# EAGLE design DrvPAPCNC (EAGLE 6.3)
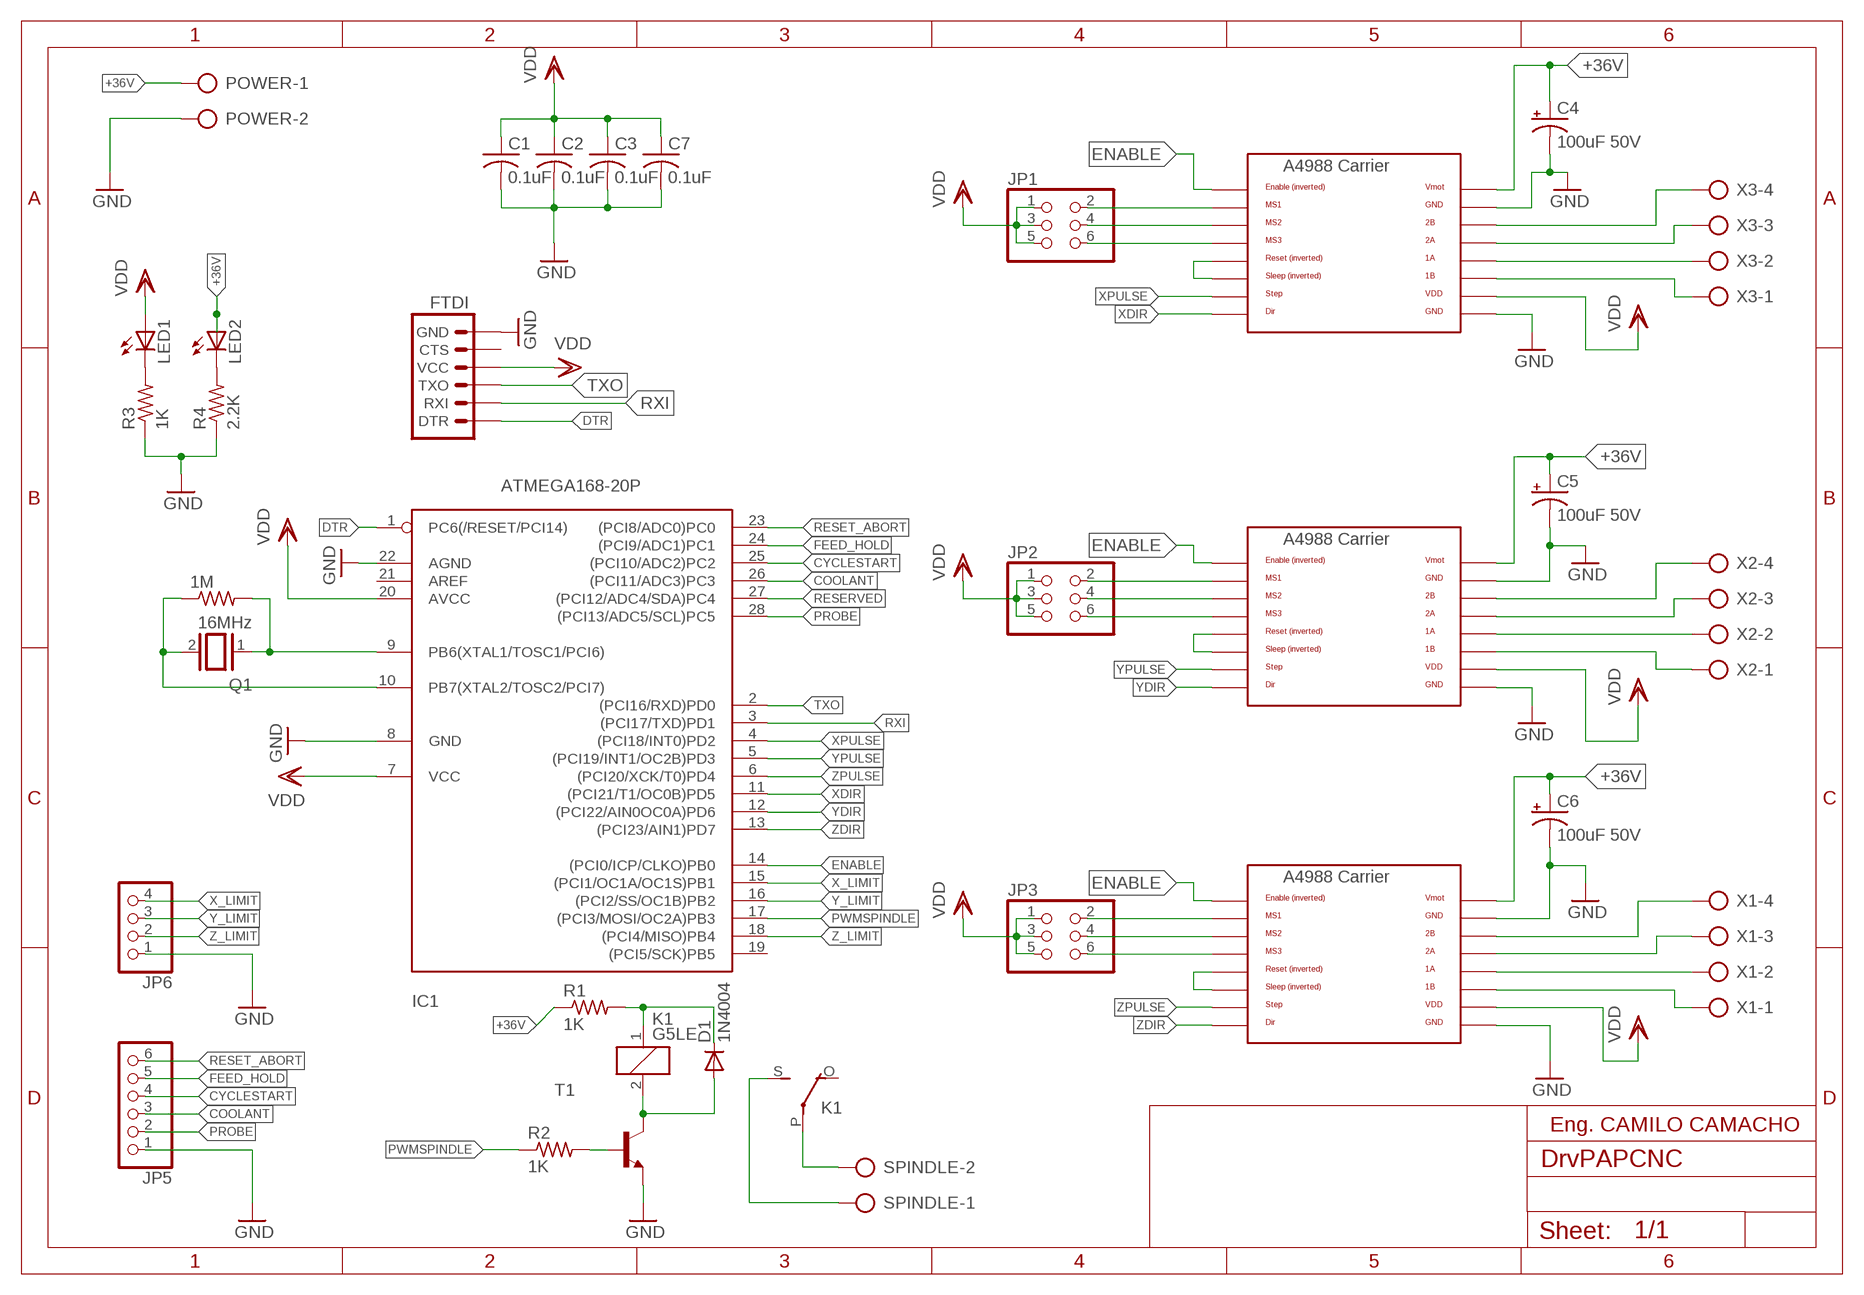
[diagram p0: schematic, sheet 1]

## Parts
1M  R-US_0204/2V  [0204V]
C1  0.1uF  C-US025-025X050  [C025-025X050]
C2  0.1uF  C-US025-025X050  [C025-025X050]
C3  0.1uF  C-US025-025X050  [C025-025X050]
C4  100uF 50V  CPOL-USE7.5-16  [E7,5-16]
C5  100uF 50V  CPOL-USE7.5-16  [E7,5-16]
C6  100uF 50V  CPOL-USE7.5-16  [E7,5-16]
C7  0.1uF  C-US025-025X050  [C025-025X050]
D1  1N4004  [DO41-10]
FTDI  ARDUINO_SERIAL_PROGRAMPTH  [1X06]
IC1  ATMEGA168-20P  [DIL28-3]
JP1  PINHD-2X3  [2X03]
JP2  PINHD-2X3  [2X03]
JP3  PINHD-2X3  [2X03]
JP5  PINHD-1X6  [1X06]
JP6  PINHD-1X4  [1X04]
K1  G5LE  [G5LE]
LED1  LED5MM  [LED5MM]
LED2  LED5MM  [LED5MM]
POWER  AK300/2  [AK300/2]
Q1  16MHz  XTAL/S  [QS]
R1  1K  R-US_0207/10  [0207/10]
R2  1K  R-US_0207/10  [0207/10]
R3  1K  R-US_0207/10  [0207/10]
R4  2.2K  R-US_0207/10  [0207/10]
SPINDLE  AK300/2  [AK300/2]
T1  2N3904-NPN-TO92-EBC  [TO92-EBC]
U$1  A4988BREAKOUT  [A4988BREAKOUT]
U$2  A4988BREAKOUT  [A4988BREAKOUT]
U$3  A4988BREAKOUT  [A4988BREAKOUT]
X1  AK300/4  [AK300/4]
X2  AK300/4  [AK300/4]
X3  AK300/4  [AK300/4]

## Nets
+36V: C4.+ C5.+ C6.+ LED2.A POWER.1 R1.1 U$1.VMOT U$2.VMOT U$3.VMOT
COOLANT: IC1.26((PCI11/ADC3)PC3) JP5.3
CYCLESTART: IC1.25((PCI10/ADC2)PC2) JP5.4
DTR: FTDI.1(DTR) IC1.1(PC6(/RESET/PCI14))
ENABLE: IC1.14((PCI0/ICP/CLKO)PB0) U$1.EN U$2.EN U$3.EN
FEED_HOLD: IC1.24((PCI9/ADC1)PC1) JP5.5
GND: C1.2 C2.2 C3.2 C4.- C5.- C6.- C7.2 FTDI.6(GND) IC1.8(GND) IC1.22(AGND) JP5.1 JP6.1 POWER.2 R3.1 R4.1 T1.E U$1.GND U$1.GND@0(GND) U$2.GND U$2.GND@0(GND) U$3.GND U$3.GND@0(GND)
N$1: U$1.2B X3.4
N$2: U$1.2A X3.3
N$3: U$1.1A X3.2
N$4: U$1.1B X3.1
N$5: U$2.1B X2.1
N$6: U$2.1A X2.2
N$7: U$2.2A X2.3
N$8: U$2.2B X2.4
N$9: U$3.2B X1.4
N$10: U$3.2A X1.3
N$11: U$3.1A X1.2
N$12: U$3.1B X1.1
N$13: K1.P(2:P) SPINDLE.2
N$14: K1.S(2:S) SPINDLE.1
N$16: JP1.2 U$1.MS1
N$17: JP1.4 U$1.MS2
N$18: JP1.6 U$1.MS3
N$19: JP2.2 U$2.MS1
N$20: JP2.4 U$2.MS2
N$21: JP2.6 U$2.MS3
N$22: JP3.2 U$3.MS1
N$23: JP3.4 U$3.MS2
N$24: JP3.6 U$3.MS3
N$25: U$3.RST U$3.SLP(SLEEP)
N$26: U$2.RST U$2.SLP(SLEEP)
N$27: U$1.RST U$1.SLP(SLEEP)
N$28: D1.C K1.1 R1.2
N$29: D1.A K1.2 T1.C
N$30: 1M.2 IC1.9(PB6(XTAL1/TOSC1/PCI6)) Q1.1
N$31: 1M.1 IC1.10(PB7(XTAL2/TOSC2/PCI7)) Q1.2
N$32: R2.2 T1.B
N$33: LED1.K(C) R3.2
N$34: LED2.K(C) R4.2
PROBE: IC1.28((PCI13/ADC5/SCL)PC5) JP5.2
PWMSPINDLE: IC1.17((PCI3/MOSI/OC2A)PB3) R2.1
RESERVED: IC1.27((PCI12/ADC4/SDA)PC4)
RESET_ABORT: IC1.23((PCI8/ADC0)PC0) JP5.6
RXI: FTDI.2(RXI) IC1.3((PCI17/TXD)PD1)
TXO: FTDI.3(TXO) IC1.2((PCI16/RXD)PD0)
VDD: C1.1 C2.1 C3.1 C7.1 FTDI.4(VCC) IC1.7(VCC) IC1.20(AVCC) JP1.1 JP1.3 JP1.5 JP2.1 JP2.3 JP2.5 JP3.1 JP3.3 JP3.5 LED1.A U$1.VDD U$2.VDD U$3.VDD
X_LIMIT: IC1.15((PCI1/OC1A/OC1S)PB1) JP6.4
XDIR: IC1.11((PCI21/T1/OC0B)PD5) U$1.DIR
XPULSE: IC1.4((PCI18/INT0)PD2) U$1.STEP
Y_LIMIT: IC1.16((PCI2/SS/OC1B)PB2) JP6.3
YDIR: IC1.12((PCI22/AIN0OC0A)PD6) U$2.DIR
YPULSE: IC1.5((PCI19/INT1/OC2B)PD3) U$2.STEP
Z_LIMIT: IC1.18((PCI4/MISO)PB4) JP6.2
ZDIR: IC1.13((PCI23/AIN1)PD7) U$3.DIR
ZPULSE: IC1.6((PCI20/XCK/T0)PD4) U$3.STEP
Unconnected: FTDI.5(CTS) IC1.19((PCI5/SCK)PB5) IC1.21(AREF) K1.O(2:O)

## Notes on the sheet
- Eng. CAMILO CAMACHO

## Library data of the parts
1M R1-R4 = rcl:R-US_: RESISTOR, American symbol
C1-C3 C7 = adafruit:C-US: CAPACITOR, American symbol
C4-C6 = adafruit:CPOL-US: POLARIZED CAPACITOR, American symbol
D1 = diode:1N4004: DIODE general purpose rectifier, 1 A
FTDI = SparkFun-Connectors:ARDUINO_SERIAL_PROGRAM: FTDI connector footprints
IC1 = adafruit:ATMEGA168*P: MICROCONTROLLER 16 kBytes FLASH 1 kBytes SRAM 512 Bytes EEPROM USART 8-channel 10 bit ADC
JP1-JP3 = pinhead:PINHD-2X3: PIN HEADER
JP5 = pinhead:PINHD-1X6: PIN HEADER
JP6 = pinhead:PINHD-1X4: PIN HEADER
K1 = relay:G5LE: RELAY 1 x switch, 10 A/120 V AC, 8 A/30 V DC, Omron; OC_FARNELL: unknown; OC_NEWARK: unknown
LED1 LED2 = adafruit:LED: LED OSRAM: - CHIPLED LG R971, LG N971, LY N971, LG Q971, LY Q971, LO R971, LY R971 LH N974, LH R974 LS Q976, LO Q976, LY Q976 LO Q996 - Hyper CHIPLED LW Q18S LB Q993, LB Q99A, LB R99A - SideLED LS A670, LO A670, LY A670, LG A670, LP A670 LB A673, LV A673, LT A673, LW A673 LH A674 LY A675 LS A676, LA A676, LO A676, LY A676, LW A676 LS A679, LY A679, LG A679 - Hyper Micro SIDELED® LS Y876, LA Y876, LO Y876, LY Y876 LT Y87S - SmartLED LW L88C, LW L88S LB L89C, LB L89S, LG L890 LS L89K, LO L89K, LY L89K LS L896, LA L896, LO L896, LY L896 - TOPLED LS T670, LO T670, LY T670, LG T670, LP T670 LSG T670, LSP T670, LSY T670, LOP T670, LYG T670 LG T671, LOG T671, LSG T671 LB T673, LV T673, LT T673, LW T673 LH T674 LS T676, LA T676, LO T676, LY T676, LB T676, LH T676, LSB T676, LW T676 LB T67C, LV T67C, LT T67C, LS T67K, LO T67K, LY T67K, LW E67C LS E67B, LA E67B, LO E67B, LY E67B, LB E67C, LV E67C, LT E67C LW T67C LS T679, LY T679, LG T679 LS T770, LO T770, LY T770, LG T770, LP T770 LB T773, LV T773, LT T773, LW T773 LH T774 LS E675, LA E675, LY E675, LS T675 LS T776, LA T776, LO T776, LY T776, LB T776 LHGB T686 LT T68C, LB T68C - Hyper Mini TOPLED® LB M676 - Mini TOPLED Santana® LG M470 LS M47K, LO M47K, LY M47K Source: http://www.osram.convergy.de/
POWER SPINDLE = con-ptr500:AK300/2: CONNECTOR; OC_FARNELL: unknown; OC_NEWARK: unknown
Q1 = special:XTAL/S: CRYSTAL
T1 = transistor-neu-to92:*-NPN-: NPN Transistror
U$1-U$3 = RepRapjr:A4988BREAKOUT
X1-X3 = con-ptr500:AK300/4: CONNECTOR; OC_FARNELL: unknown; OC_NEWARK: unknown

## Board
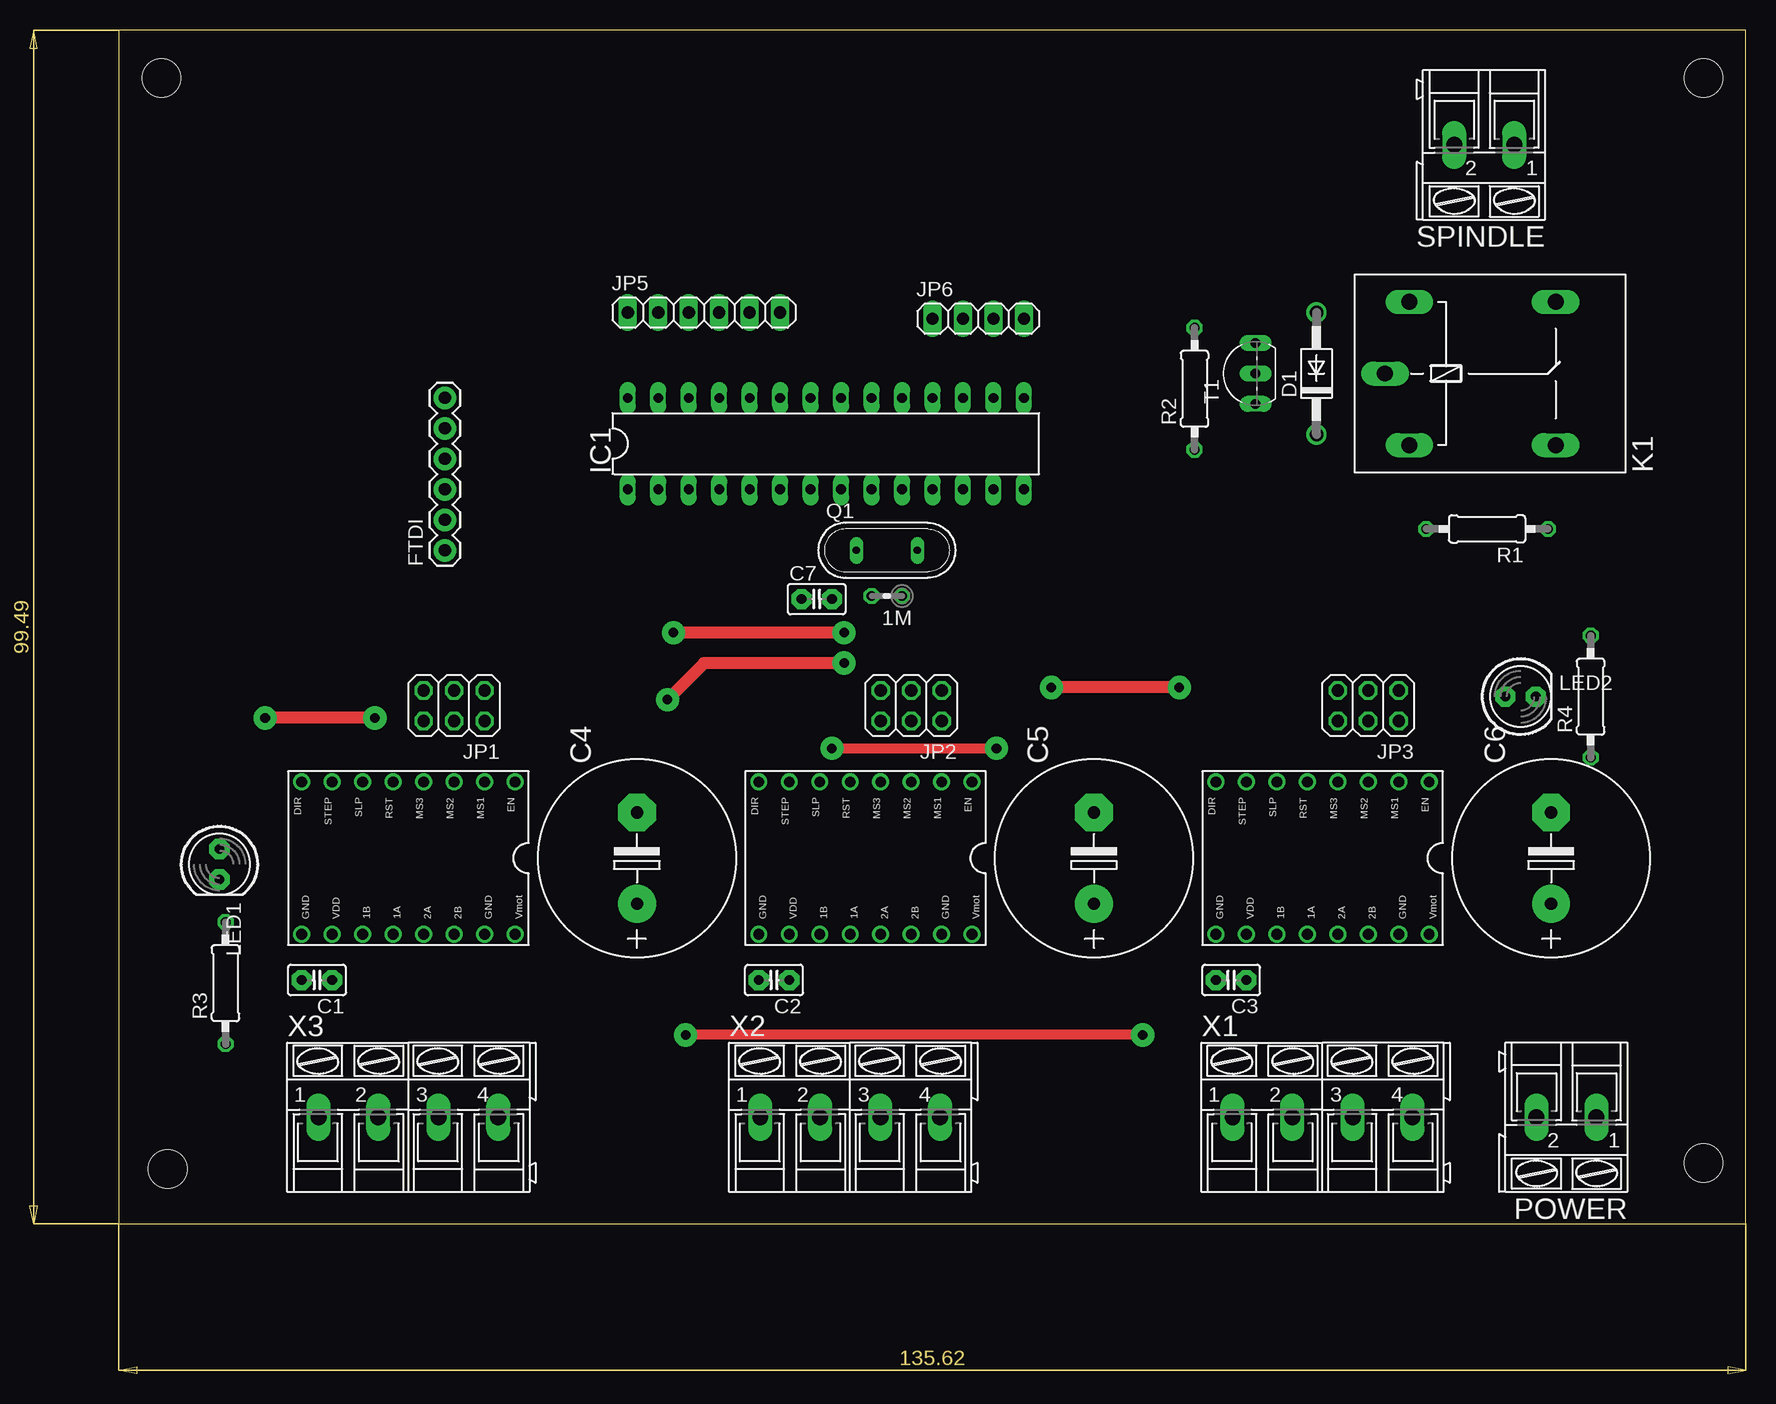
[diagram p1: board, top side]
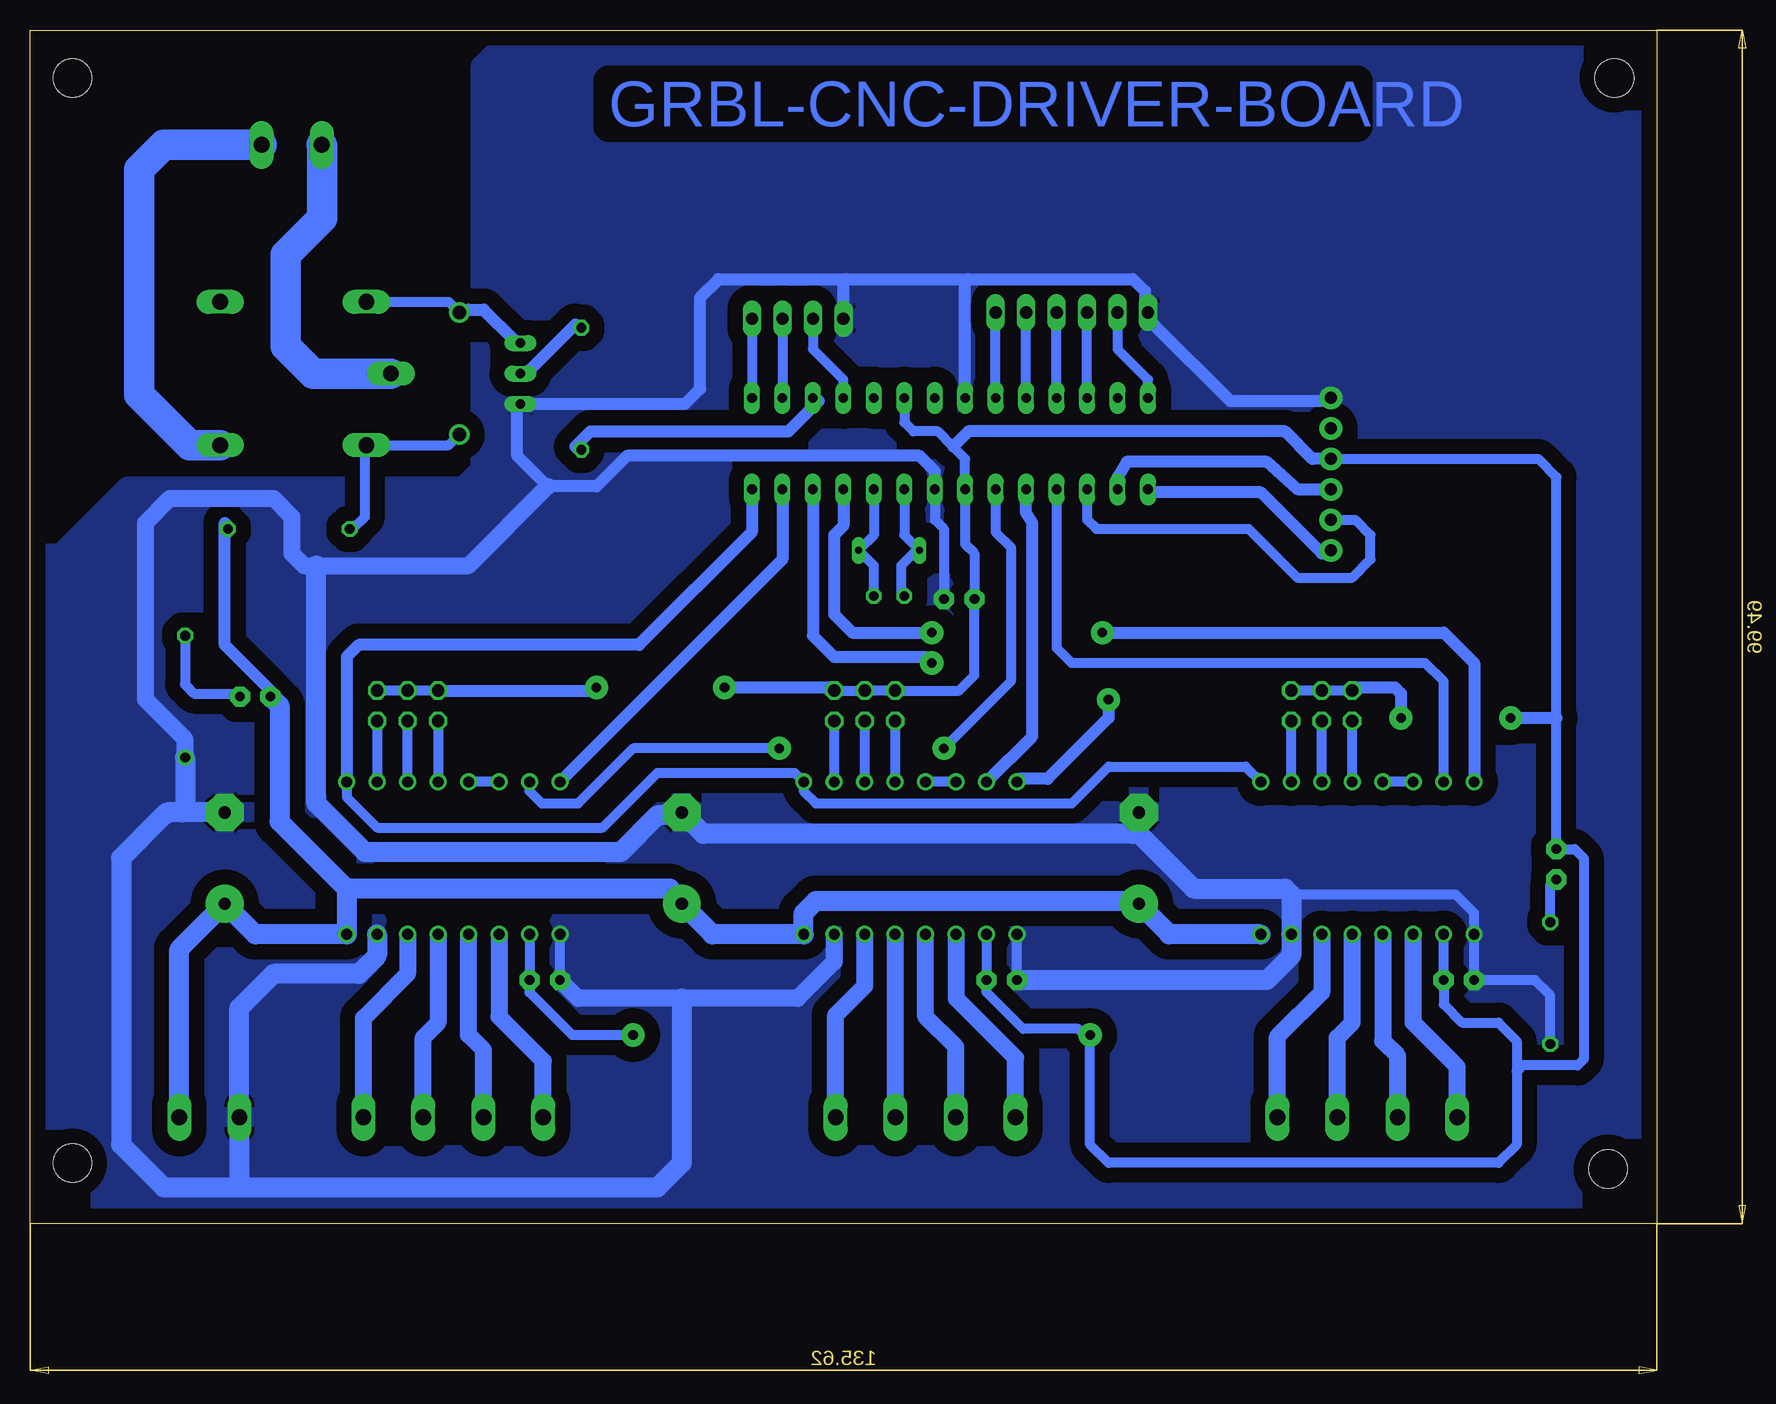
[diagram p2: board, bottom side, seen from below]

Size 135.62 x 99.49 mm. Coordinates in mm from the lower left corner, seen from the top.
Outline: 0,0 135.62,0 135.62,99.49 0,99.49 0,0
Copper layers (1+16): Top 0.035mm / dielectric 1.5mm / Bottom 0.035mm
Design rules "default *": minimum track width 1mm, minimum drill 24mil, track to track 0.4mm, track to pad 0.4mm, pad to pad 0.4mm, via to via 0.4mm, smd to smd 0.1mm, copper to edge 1mm, drill to drill 1mm, minimum pad ring 10mil, minimum via ring 8mil, stop-mask expansion 4mil, vias tented up to drill 0mil, thermal gap 10mil
Holes 3.2 mm at 4.06,4.57 132.08,5.08 132.08,95.5 3.56,95.5

### Footprints (pad centres in the part's own frame; a part is rotated, then mirrored left to right if it is on the bottom)
0204V = drill 0.813 octagon: 1 -1.27,0; 2 1.27,0
C025-025X050 = drill 0.813 pad 1.676 octagon: 1 -1.27,0; 2 1.27,0
E7,5-16 = drill 1.016 pad 3.15: + -3.81,0 | drill 1.016 pad 3.15 octagon: - 3.81,0
DO41-10 = drill 1.118: A 5.08,0; C -5.08,0
1X06 = drill 1.016 pad 1.88: 1 0,0; 2 2.54,0; 3 5.08,0; 4 7.62,0; 5 10.16,0; 6 12.7,0
DIL28-3 = drill 0.813 long: 1 -16.51,-3.81; 2 -13.97,-3.81; 3 -11.43,-3.81; 4 -8.89,-3.81; 5 -6.35,-3.81; 6 -3.81,-3.81; 7 -1.27,-3.81; 8 1.27,-3.81; 9 3.81,-3.81; 10 6.35,-3.81; 11 8.89,-3.81; 12 11.43,-3.81; 13 13.97,-3.81; 14 16.51,-3.81; 15 16.51,3.81; 16 13.97,3.81; 17 11.43,3.81; 18 8.89,3.81; 19 6.35,3.81; 20 3.81,3.81; 21 1.27,3.81; 22 -1.27,3.81; 23 -3.81,3.81; 24 -6.35,3.81; 25 -8.89,3.81; 26 -11.43,3.81; 27 -13.97,3.81; 28 -16.51,3.81
2X03 = drill 1.016 octagon: 1 -2.54,-1.27; 2 -2.54,1.27; 3 0,-1.27; 4 0,1.27; 5 2.54,-1.27; 6 2.54,1.27
1X06' = drill 1.016 long: 1 -6.35,0; 2 -3.81,0; 3 -1.27,0; 4 1.27,0; 5 3.81,0; 6 6.35,0
1X04 = drill 1.016 long: 1 -3.81,0; 2 -1.27,0; 3 1.27,0; 4 3.81,0
G5LE = drill 1.321 long: 1 -7.493,-5.969; 2 -7.493,5.969; O 4.699,5.969; P -9.525,0; S 4.699,-5.969
LED5MM = drill 0.813 pad 1.676 octagon: A -1.27,0; K 1.27,0
AK300/2 = drill 1.321 long: 1 -2.515,0; 2 2.489,0
QS = drill 0.61 long: 1 -2.54,0; 2 2.54,0
0207/10 = drill 0.813 octagon: 1 -5.08,0; 2 5.08,0
TO92-EBC = drill 0.813 long: B 0,-1.27; C 2.54,-1.27; E -2.54,-1.27
A4988BREAKOUT = drill 0.9: 1A 8.89,1.27; 1B 11.43,1.27; 2A 6.35,1.27; 2B 3.81,1.27; DIR 16.51,-11.43; EN -1.27,-11.43; GND 16.51,1.27; GND@0 1.27,1.27; MS1 1.27,-11.43; MS2 3.81,-11.43; MS3 6.35,-11.43; RST 8.89,-11.43; SLP 11.43,-11.43; STEP 13.97,-11.43; VDD 13.97,1.27; VMOT -1.27,1.27
AK300/4 = drill 1.321 long: 1 -7.493,0; 2 -2.515,0; 3 2.515,0; 4 7.493,0

### Placement (x,y rotation side)
1M  64.01,52.32 180 top
C1  16.51,20.32 180 top
C2  54.61,20.32 180 top
C3  92.71,20.32 180 top
C4  43.18,30.48 90 top
C5  81.28,30.48 90 top
C6  119.38,30.48 90 top
C7  58.17,52.07 0 top
D1  99.82,70.87 90 top
FTDI  27.18,56.13 90 top
IC1  58.93,65.02 0 top
JP1  27.94,43.18 180 top
JP2  66.04,43.18 180 top
JP3  104.14,43.18 180 top
JP5  [1X06']  48.77,75.95 0 top
JP6  71.63,75.44 0 top
K1  115.06,70.87 0 top
LED1  8.38,29.97 270 top
LED2  116.84,43.94 0 top
POWER  120.65,8.89 180 top
Q1  64.01,56.13 0 top
R1  114.05,57.91 180 top
R2  89.66,69.6 90 top
R3  8.89,20.07 90 top
R4  122.68,43.94 90 top
SPINDLE  113.79,89.92 180 top
T1  93.47,70.87 90 top
U$1  31.75,25.4 180 top
U$2  69.85,25.4 180 top
U$3  107.95,25.4 180 top
X1  100.33,8.89 0 top
X2  60.96,8.89 0 top
X3  24.13,8.89 0 top

### Tracks (layer width: path | path; a pad name or v marks a point on that pad's centre or on a via)
+36V
  Bottom 1: R1.1 119.38,58.42 119.38,48.26 115.57,44.45 LED2.A
  Bottom 1.676: POWER.1 123.17,22.89 C6.+ 116.84,24.13 U$3.VMOT 109.22,27.94 | 109.22,27.94 82.3,27.94 81.03,26.67 C5.+ 78.74,24.13 U$2.VMOT 71.12,25.91 70.1,26.92 43.43,26.92 C4.+ 40.64,24.13 U$1.VMOT | LED2.A 114.81,43.18 114.81,33.53 109.22,27.94
COOLANT
  Bottom 0.813: IC1.26 JP5.3
CYCLESTART
  Bottom 0.813: IC1.25 JP5.4
DTR
  Bottom 1: IC1.1 41.91,60.96 33.02,60.96 27.94,55.88 FTDI.1
ENABLE
  Bottom 0.813: U$3.EN 109.22,35.56 106.68,33.02 87.88,33.02 83.31,37.59 71.88,37.59 U$2.EN 71.12,36.07 70.1,35.05 48.77,35.05 45.72,38.1 34.29,38.1 U$1.EN
  Bottom 1.016: IC1.14 75.44,57.66 84.84,48.26 108.2,48.26 109.22,47.24 U$3.EN
FEED_HOLD
  Bottom 0.813: IC1.24 JP5.5
GND
  Bottom 0.813: C2.2 U$2.GND | C3.2 U$3.GND | R3.1 8.89,19.05 10.16,20.32 C1.2 U$1.GND 15.24,25.91 16.76,27.43 30.48,27.43 | IC1.8 60.2,58.67 59.44,57.91 C7.2
  Bottom 1: FTDI.6 27.94,68.58 35.56,68.58 41.91,74.93 JP5.1 | 124.46,34.04 124.46,34.29 124.33,34.16
  Bottom 1.016: 67.56,78.74 78.23,78.74 79.76,77.22 79.76,69.6 81.03,68.33 T1.E 95,68.07 95,64.01 92.46,61.47 88.39,61.47 85.85,64.01 61.47,64.01 60.2,62.74 IC1.8 | 67.56,78.74 57.4,78.74 | 57.4,78.74 43.69,78.74 42.67,77.72 42.67,76.2 JP5.1 | JP6.1 67.82,78.49 67.56,78.74 | IC1.22 57.66,78.49 57.4,78.74 | 79.5,32.51 79.76,32.51 81.28,34.04
  Bottom 1.422: U$2.GND@0 68.58,21.84 71.63,18.8 81.28,18.8 89.92,18.8 C3.2 | R4.1 122.68,40.39 125.98,43.69 125.98,58.42 123.95,60.45 115.32,60.45 113.79,58.93 113.79,55.88 112.78,54.86 111.76,54.86 99.06,54.86 92.46,61.47
  Bottom 1.676: U$3.GND@0 106.68,22.35 108.2,20.83 115.32,20.83 118.16,17.98 POWER.2 118.16,3.25 118.36,3.05 | C6.- 122.94,34.29 | 122.94,34.29 124.21,34.29 124.33,34.16 124.46,34.04 128.02,30.48 128.02,6.6 124.46,3.05 118.36,3.05 | 118.36,3.05 83.31,3.05 81.28,5.08 81.28,18.8 | C2.2 32.51,20.32 30.48,22.35 U$1.GND@0 30.48,27.43 30.99,27.94 38.61,27.94 43.18,32.51 C4.- 43.18,33.02 43.69,32.51 79.5,32.51 C5.- | R4.1 122.68,34.54 122.94,34.29 | 81.28,34.04 83.31,34.04 86.36,30.99 107.7,30.99 111.76,35.05 111.76,54.86
  pour Bottom (isolate 1.27): -2.03,99.57 -2.03,0 135.64,0 135.64,55.88 133.1,55.88 127.51,61.47 99.57,61.47 98.04,62.99 98.04,96.52 95,99.57
N$1
  Bottom 1.422: U$1.2B 27.94,19.3 31.62,15.62 X3.4
N$2
  Bottom 1.422: X3.3 26.64,15.52 25.4,16.76 U$1.2A
N$3
  Bottom 1.422: U$1.1A 22.86,15.24 21.61,13.99 X3.2
N$4
  Bottom 1.422: X3.1 16.64,13.08 20.32,16.76 U$1.1B
N$5
  Bottom 1.422: U$2.1B 58.42,18.8 53.47,13.84 X2.1
N$6
  Bottom 1.422: X2.2 58.45,14.76 60.96,17.27 U$2.1A
N$7
  Bottom 1.422: U$2.2A 63.5,8.91 X2.3
N$8
  Bottom 1.422: U$2.2B 66.04,19.81 68.45,17.4 X2.4
N$9
  Bottom 1.422: U$3.2B 104.14,20.83 107.82,17.14 X1.4
N$10
  Bottom 1.422: U$3.2A 101.6,16.76 102.84,15.52 X1.3
N$11
  Bottom 1.422: X1.2 97.81,14.5 99.06,15.75 U$3.1A
N$12
  Bottom 1.422: U$3.1B 96.52,17.27 92.84,13.59 X1.1
N$13
  Bottom 2.54: K1.P 112.01,70.87 114.3,73.15 114.3,80.77 111.25,83.82 111.25,89.86 SPINDLE.2
N$14
  Bottom 2.54: K1.S 122.3,64.9 126.49,69.09 126.49,87.88 124.46,89.92 SPINDLE.1
N$16
  Bottom 0.813: U$1.MS1 JP1.2
N$17
  Bottom 0.813: U$1.MS2 JP1.4
N$18
  Bottom 0.813: U$1.MS3 JP1.6
N$19
  Bottom 0.813: JP2.2 U$2.MS1
N$20
  Bottom 0.813: JP2.4 U$2.MS2
N$21
  Bottom 0.813: JP2.6 U$2.MS3
N$22
  Bottom 0.813: JP3.2 U$3.MS1
N$23
  Bottom 0.813: U$3.MS2 JP3.4
N$24
  Bottom 0.813: JP3.6 U$3.MS3
N$25
  Bottom 0.813: U$3.SLP U$3.RST
N$26
  Bottom 0.813: U$2.SLP U$2.RST
N$27
  Bottom 0.813: U$1.SLP U$1.RST
N$28
  Bottom 0.813: R1.2 108.71,57.91 107.7,58.93 107.7,64.77 K1.1 100.71,64.9 D1.C
N$29
  Bottom 0.813: K1.2 100.71,76.83 D1.A
  Bottom 1: T1.C 95.25,73.66 97.79,76.2 99.06,76.2 D1.A
N$30
  Bottom 0.813: IC1.9 62.74,57.4 Q1.1 61.72,56.13 62.99,54.86 62.99,52.58 1M.2
N$31
  Bottom 0.813: IC1.10 65.28,57.4 Q1.2 65.28,54.86 1M.1
N$32
  Bottom 1: R2.2 90.17,74.93 93.98,71.12 T1.B
N$33
  Bottom 0.813: R3.2 8.89,28.19 LED1.K
N$34
  Bottom 0.813: R4.2 122.68,44.96 121.92,44.2 118.36,44.2 LED2.K
PROBE
  Bottom 0.813: IC1.28 42.42,70.36 44.96,72.9 JP5.2
PWMSPINDLE
  Bottom 1: IC1.17 69.85,68.58 72.39,66.04 88.9,66.04 90.17,64.77 R2.1
RESET_ABORT
  Bottom 0.813: IC1.23 JP5.6
RXI
  Bottom 0.813: IC1.3 47.5,58.67 46.74,57.91 34.04,57.91 29.97,53.85 25.4,53.85 23.88,55.37 23.88,57.4 25.15,58.67 FTDI.2
TXO
  Bottom 1: IC1.2 44.96,62.23 44.2,63.5 32.51,63.5 29.97,61.24 FTDI.3
VDD  (via drill 0.8 pad 1.93)
  Top 0.813: v85.34,15.75 v47.24,15.75
  Top 1.016: v21.34,42.16 v12.19,42.16 | v88.39,44.7 v77.72,44.7
  Bottom 0.813: U$1.VDD C1.1 17.78,18.29 16.26,16.76 13.21,16.76 11.68,15.24 11.68,12.7 | U$2.VDD C2.1 55.88,19.3 52.83,16.26 48.26,16.26 47.24,15.24 | C3.1 U$3.VDD 93.98,19.3 90.42,15.75 v85.34,15.75 | JP1.5 JP1.3 JP1.1 | JP2.1 JP2.3 JP2.5 58.17,44.45 56.9,45.72 C7.1 56.9,55.88 57.66,56.64 IC1.7 57.66,63.75 58.67,64.77 59.94,66.04 61.98,66.04 62.74,66.8 IC1.20 | 11.68,12.7 11.68,6.6 13.21,5.08 45.72,5.08 47.24,6.6 47.24,15.24 | 47.24,15.24 v47.24,15.75 | 11.68,12.7 11.18,13.21 6.6,13.21 6.1,13.72 6.1,30.48 6.86,31.24 LED1.A 8.38,42.16 8.38,62.23 9.91,63.75 FTDI.4 | JP3.5 JP3.3 JP3.1
  Bottom 1.016: FTDI.4 28.7,63.75 30.99,66.04 57.4,66.04 58.67,64.77 | JP1.5 25.4,44.7 21.84,44.7 21.34,44.2 v21.34,42.16 | v12.19,42.16 8.38,42.16 | JP3.5 88.65,44.45 v88.39,44.7 | v77.72,44.7 68.83,44.7 JP2.1
X_LIMIT
  Bottom 0.813: JP6.4 IC1.15
XDIR  (via drill 0.8 pad 1.93)
  Top 1.016: v60.45,49.28 v46.23,49.28
  Bottom 1.016: IC1.11 67.82,58.17 68.58,57.4 68.58,50.8 67.06,49.28 v60.45,49.28 | v46.23,49.28 17.78,49.28 15.24,46.74 U$1.DIR
XPULSE
  Bottom 0.813: U$1.STEP 17.78,45.21 19.3,46.74 48.77,46.74 50.04,48.01 IC1.4
Y_LIMIT
  Bottom 0.813: JP6.3 IC1.16
YDIR  (via drill 0.8 pad 1.93)
  Top 1.016: v60.45,46.74 48.77,46.74 v45.72,43.69
  Bottom 1.016: IC1.12 70.36,49.02 68.58,47.24 60.96,47.24 v60.45,46.74 | v45.72,43.69 45.72,42.16 50.8,37.08 53.09,37.08 U$2.DIR
YPULSE
  Bottom 1: U$2.STEP 52.07,40.64 52.07,58.42 52.52,59.18 52.58,59.24 IC1.5
Z_LIMIT
  Bottom 0.813: IC1.18 67.82,70.36 70.36,72.9 JP6.2
ZDIR
  Bottom 1.016: IC1.13 72.9,55.37 U$3.DIR
ZPULSE  (via drill 0.8 pad 1.93)
  Top 0.813: v59.44,39.62 v73.15,39.62
  Bottom 0.813: IC1.6 55.12,57.66 53.85,56.39 53.85,45.21 v59.44,39.62 | v73.15,39.62 85.34,39.62 89.92,35.05 92.96,35.05 93.98,36.07 U$3.STEP

### Text on the board
Bottom: GRBL-CNC-DRIVER-BOARD